# EAGLE board ST-BOARD-1-02 (EAGLE 9.3.0), part 1 of 2
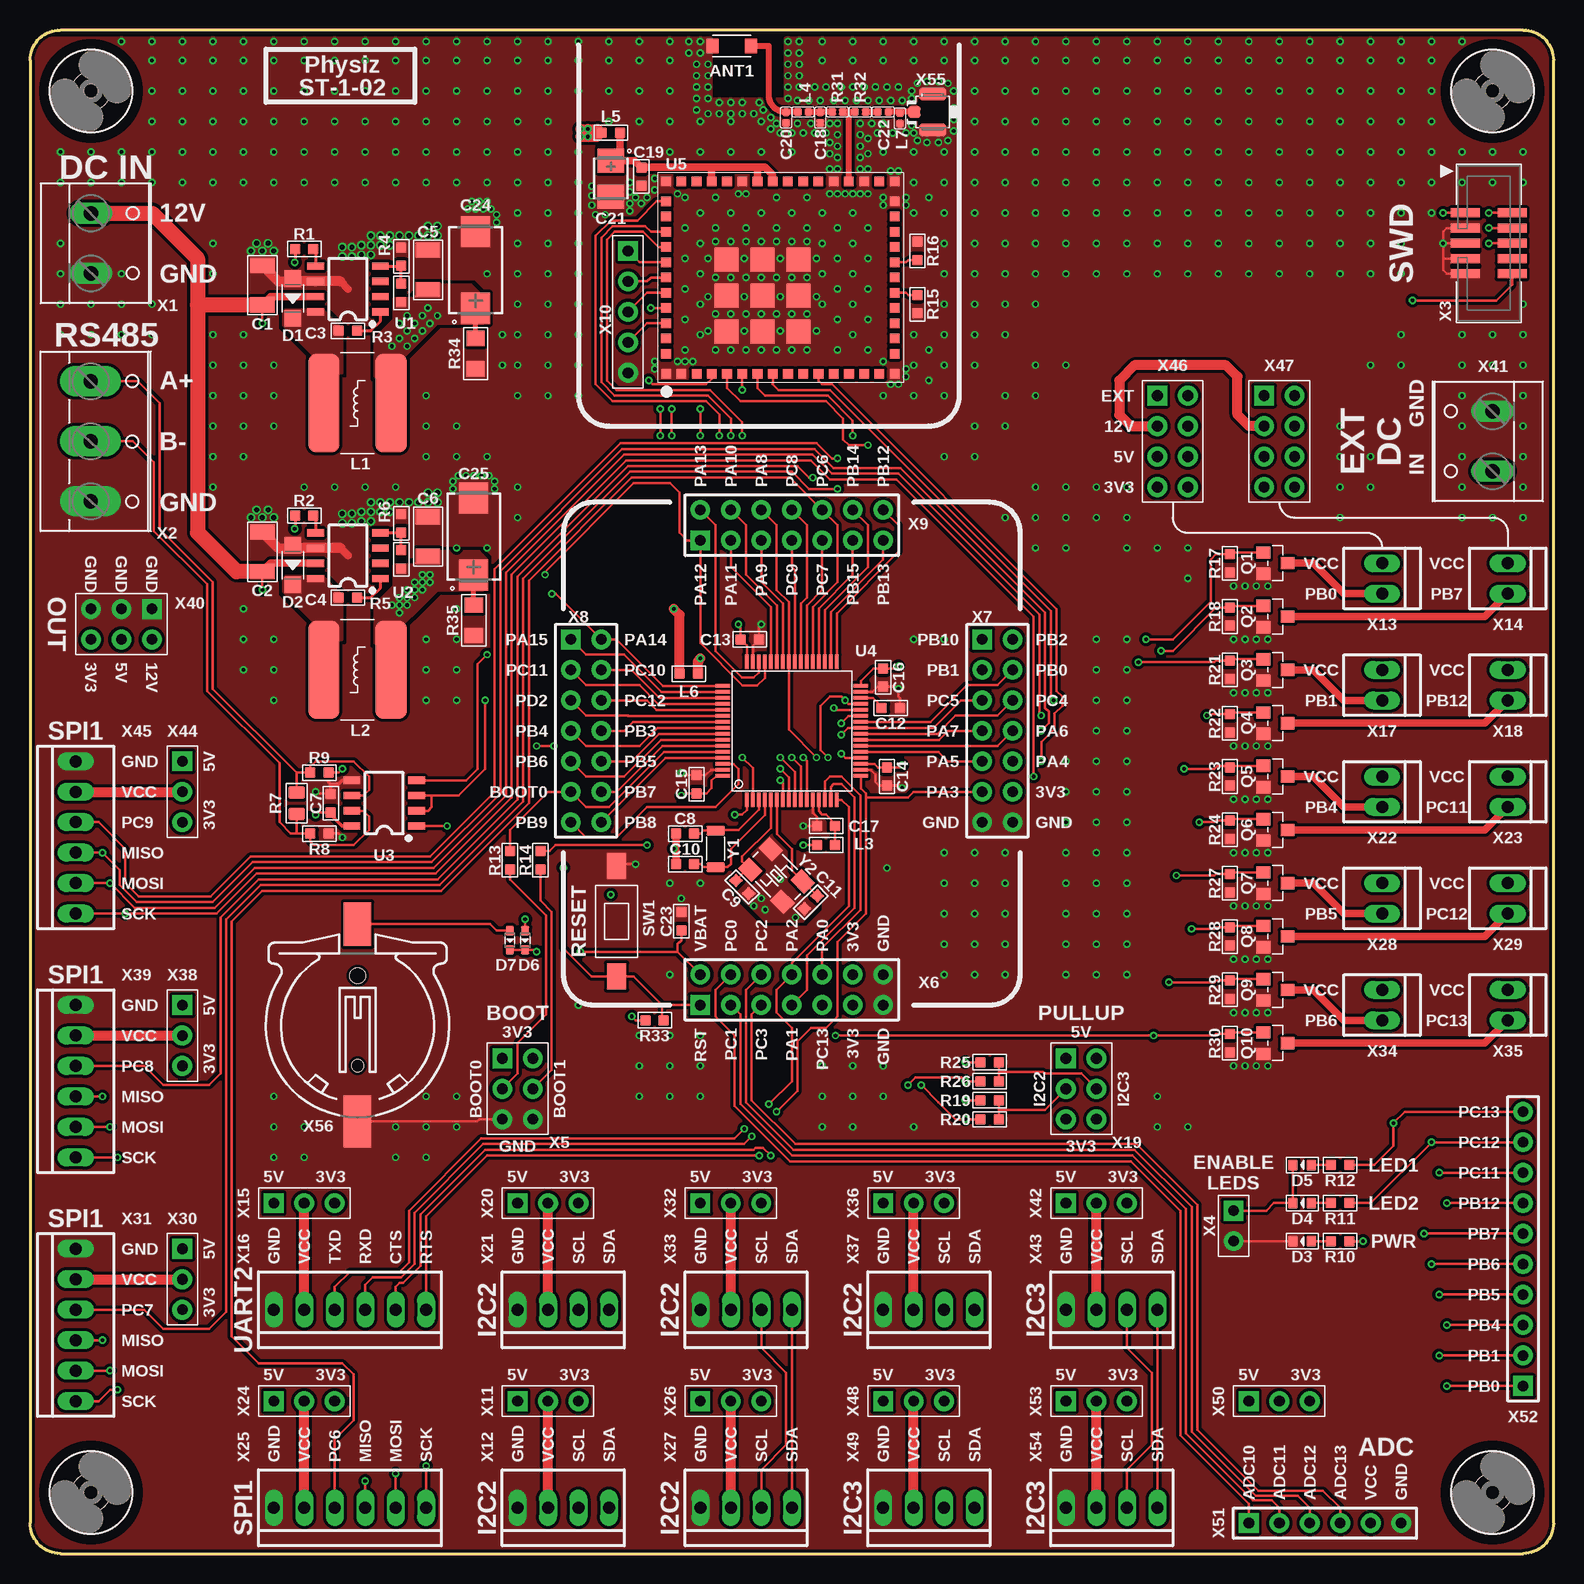
[diagram p4: board, top side]
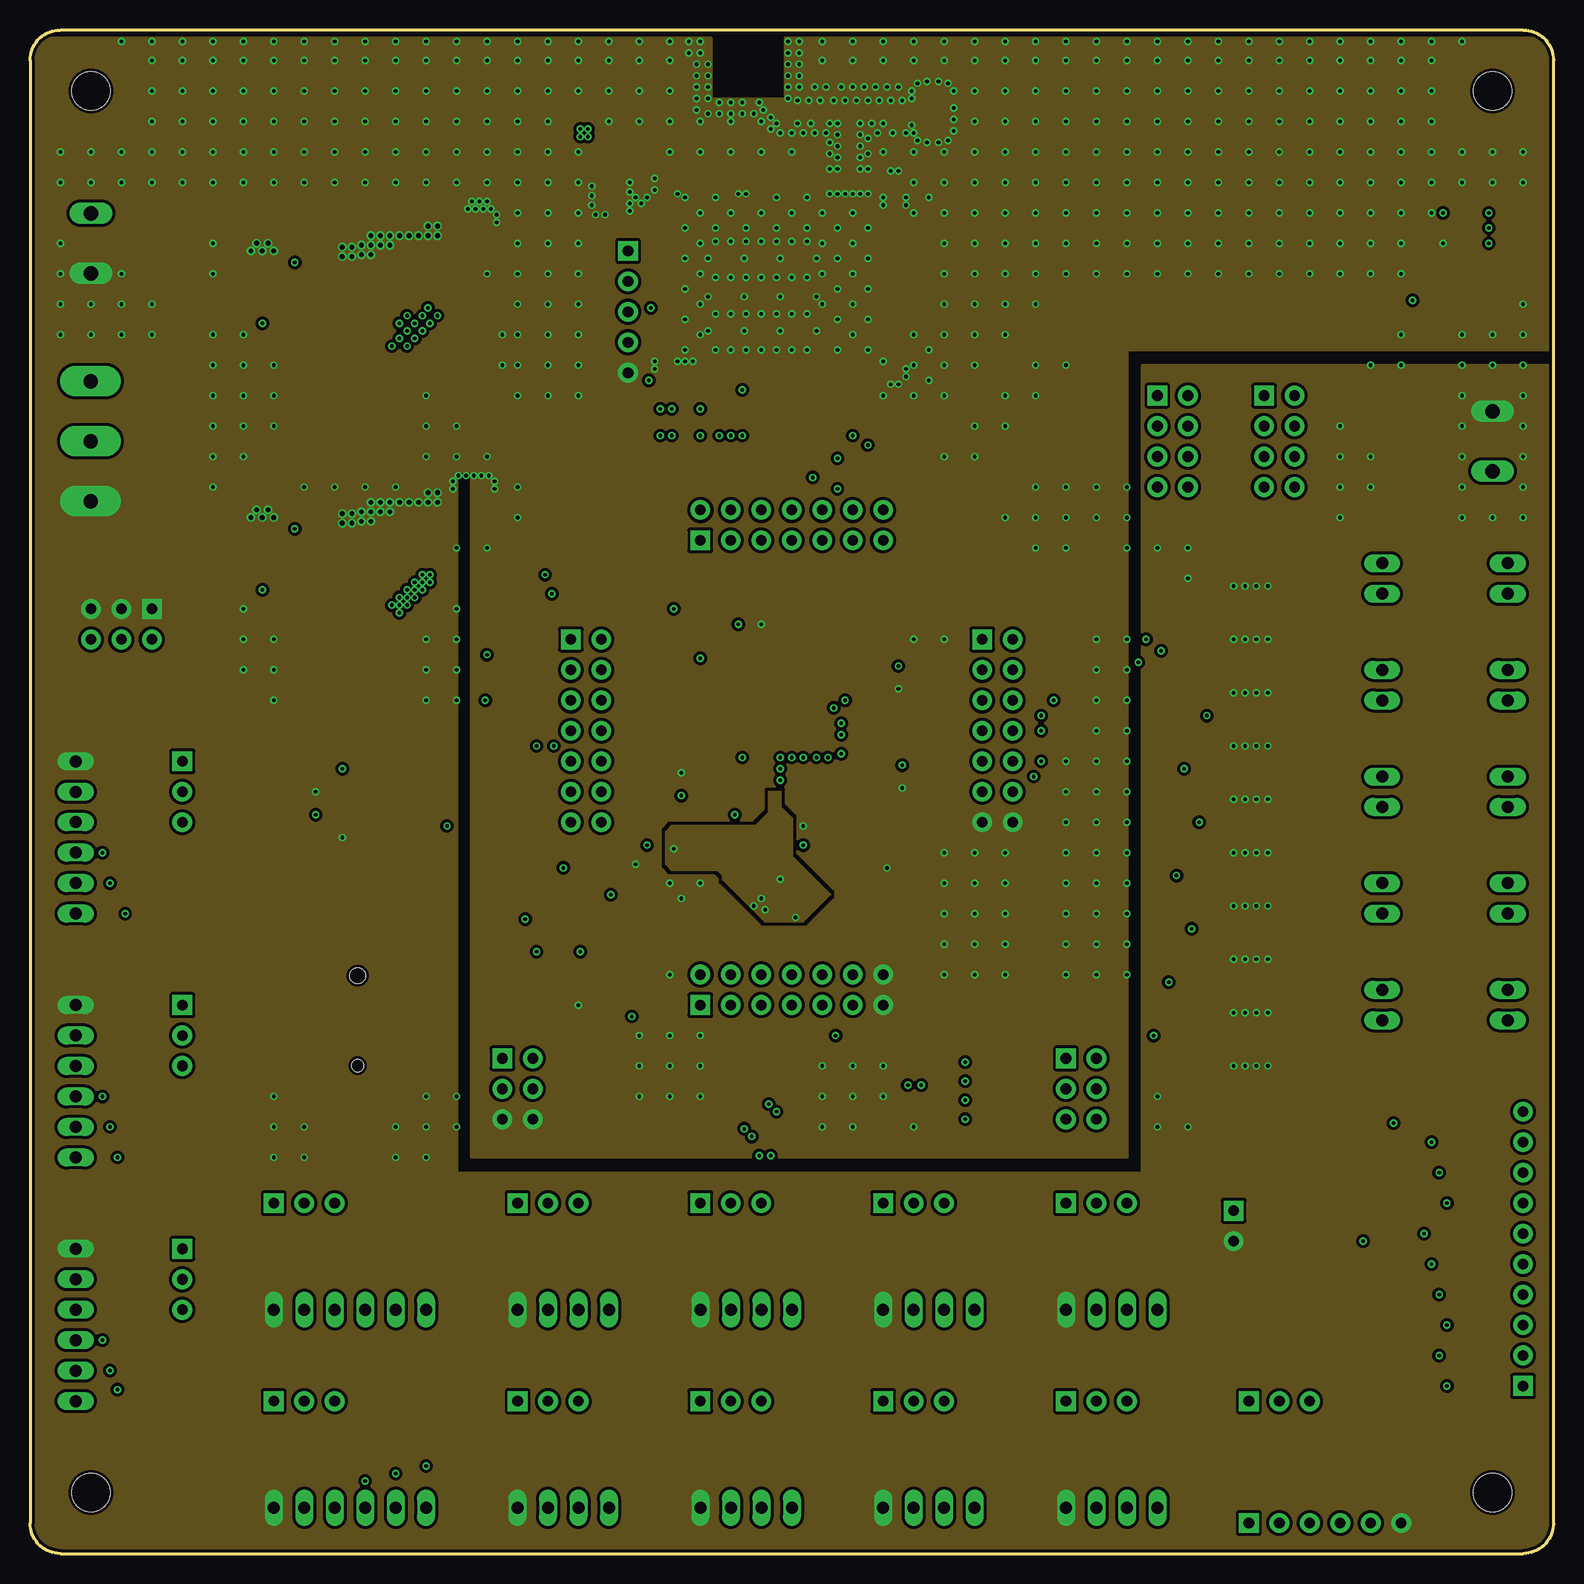
[diagram p5: board, inner layer GND]
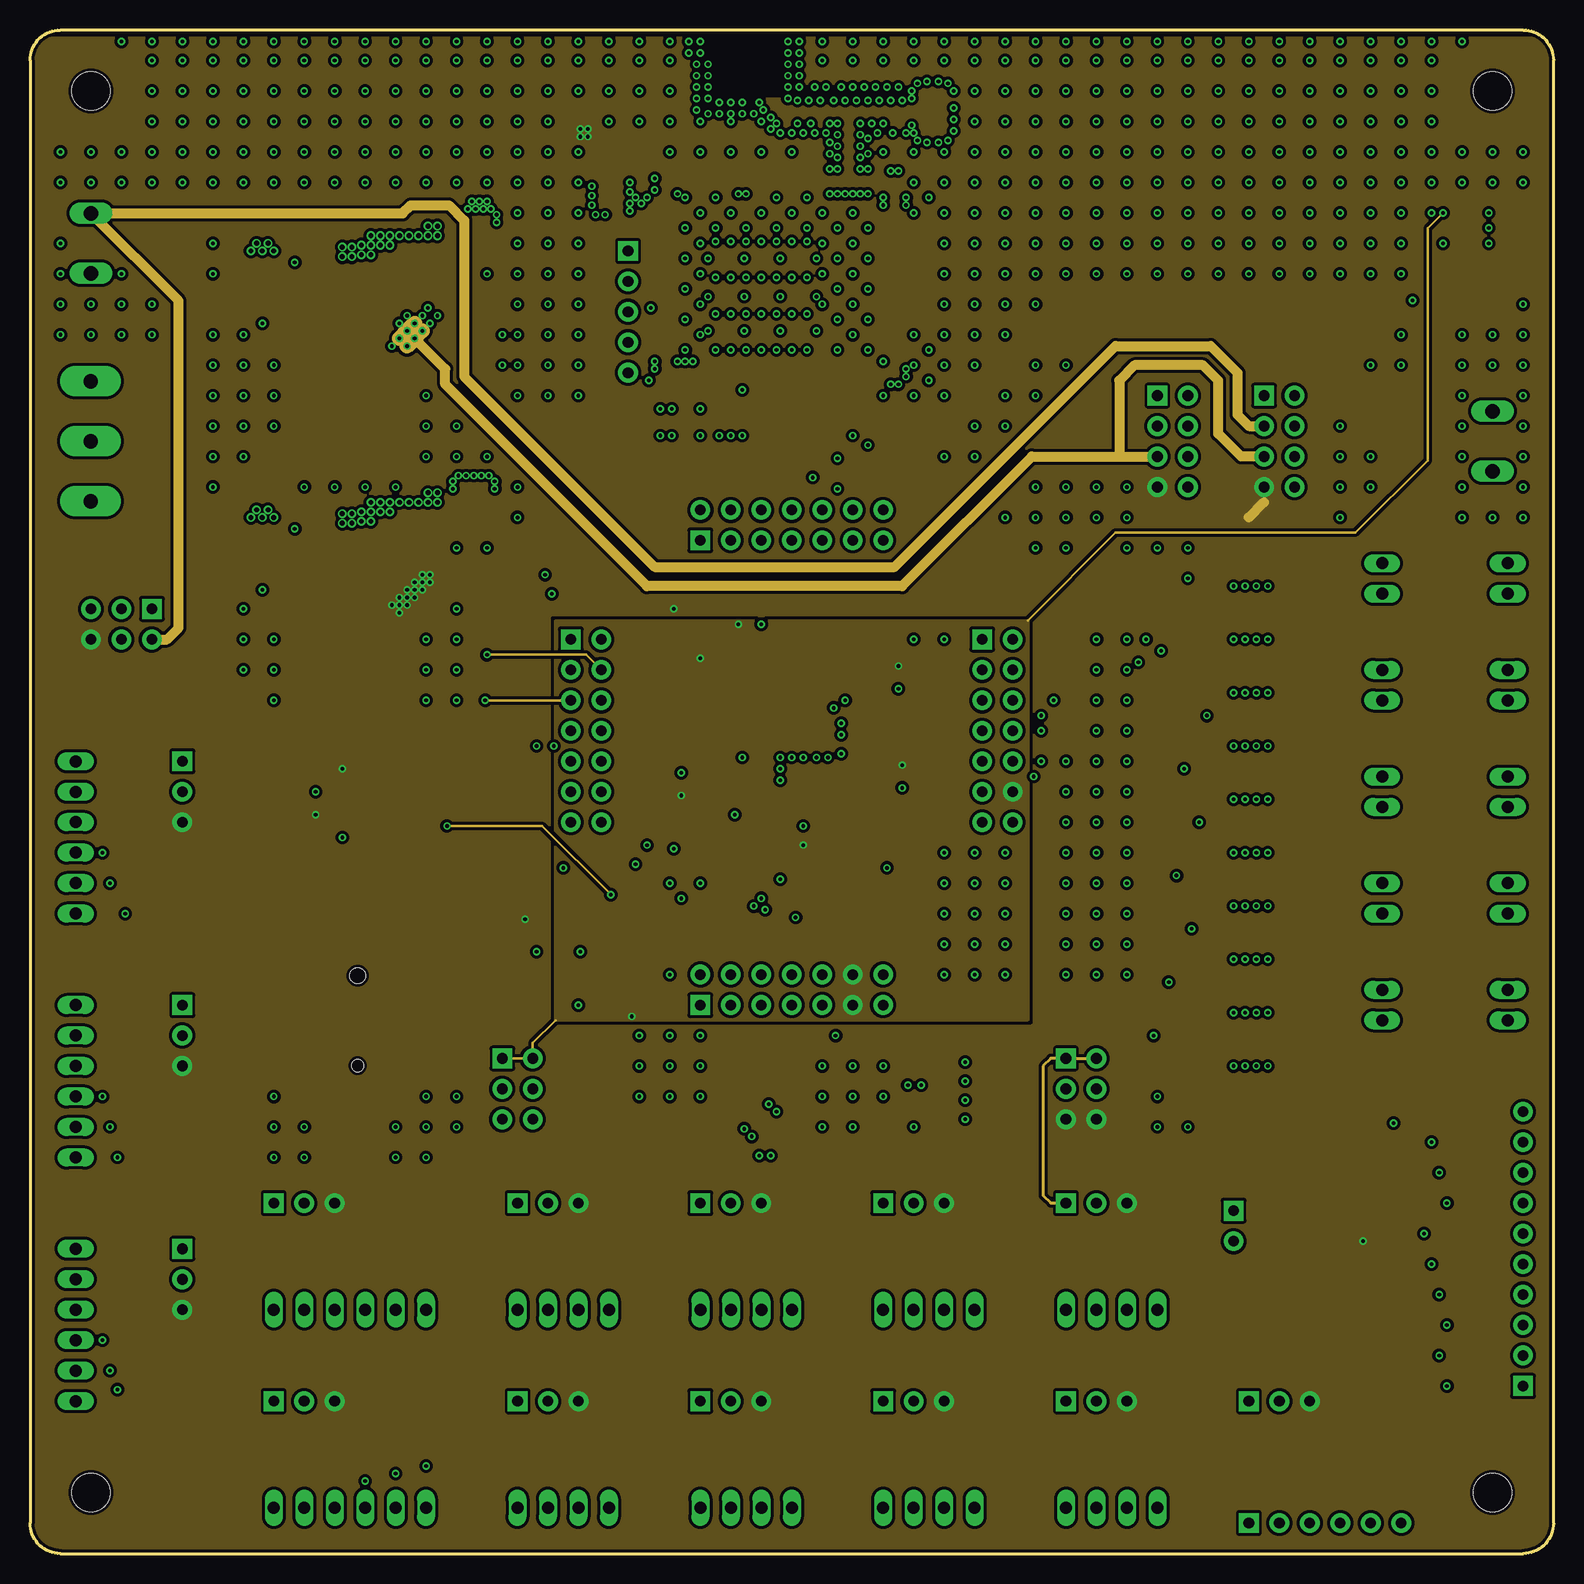
[diagram p6: board, inner layer VCC]
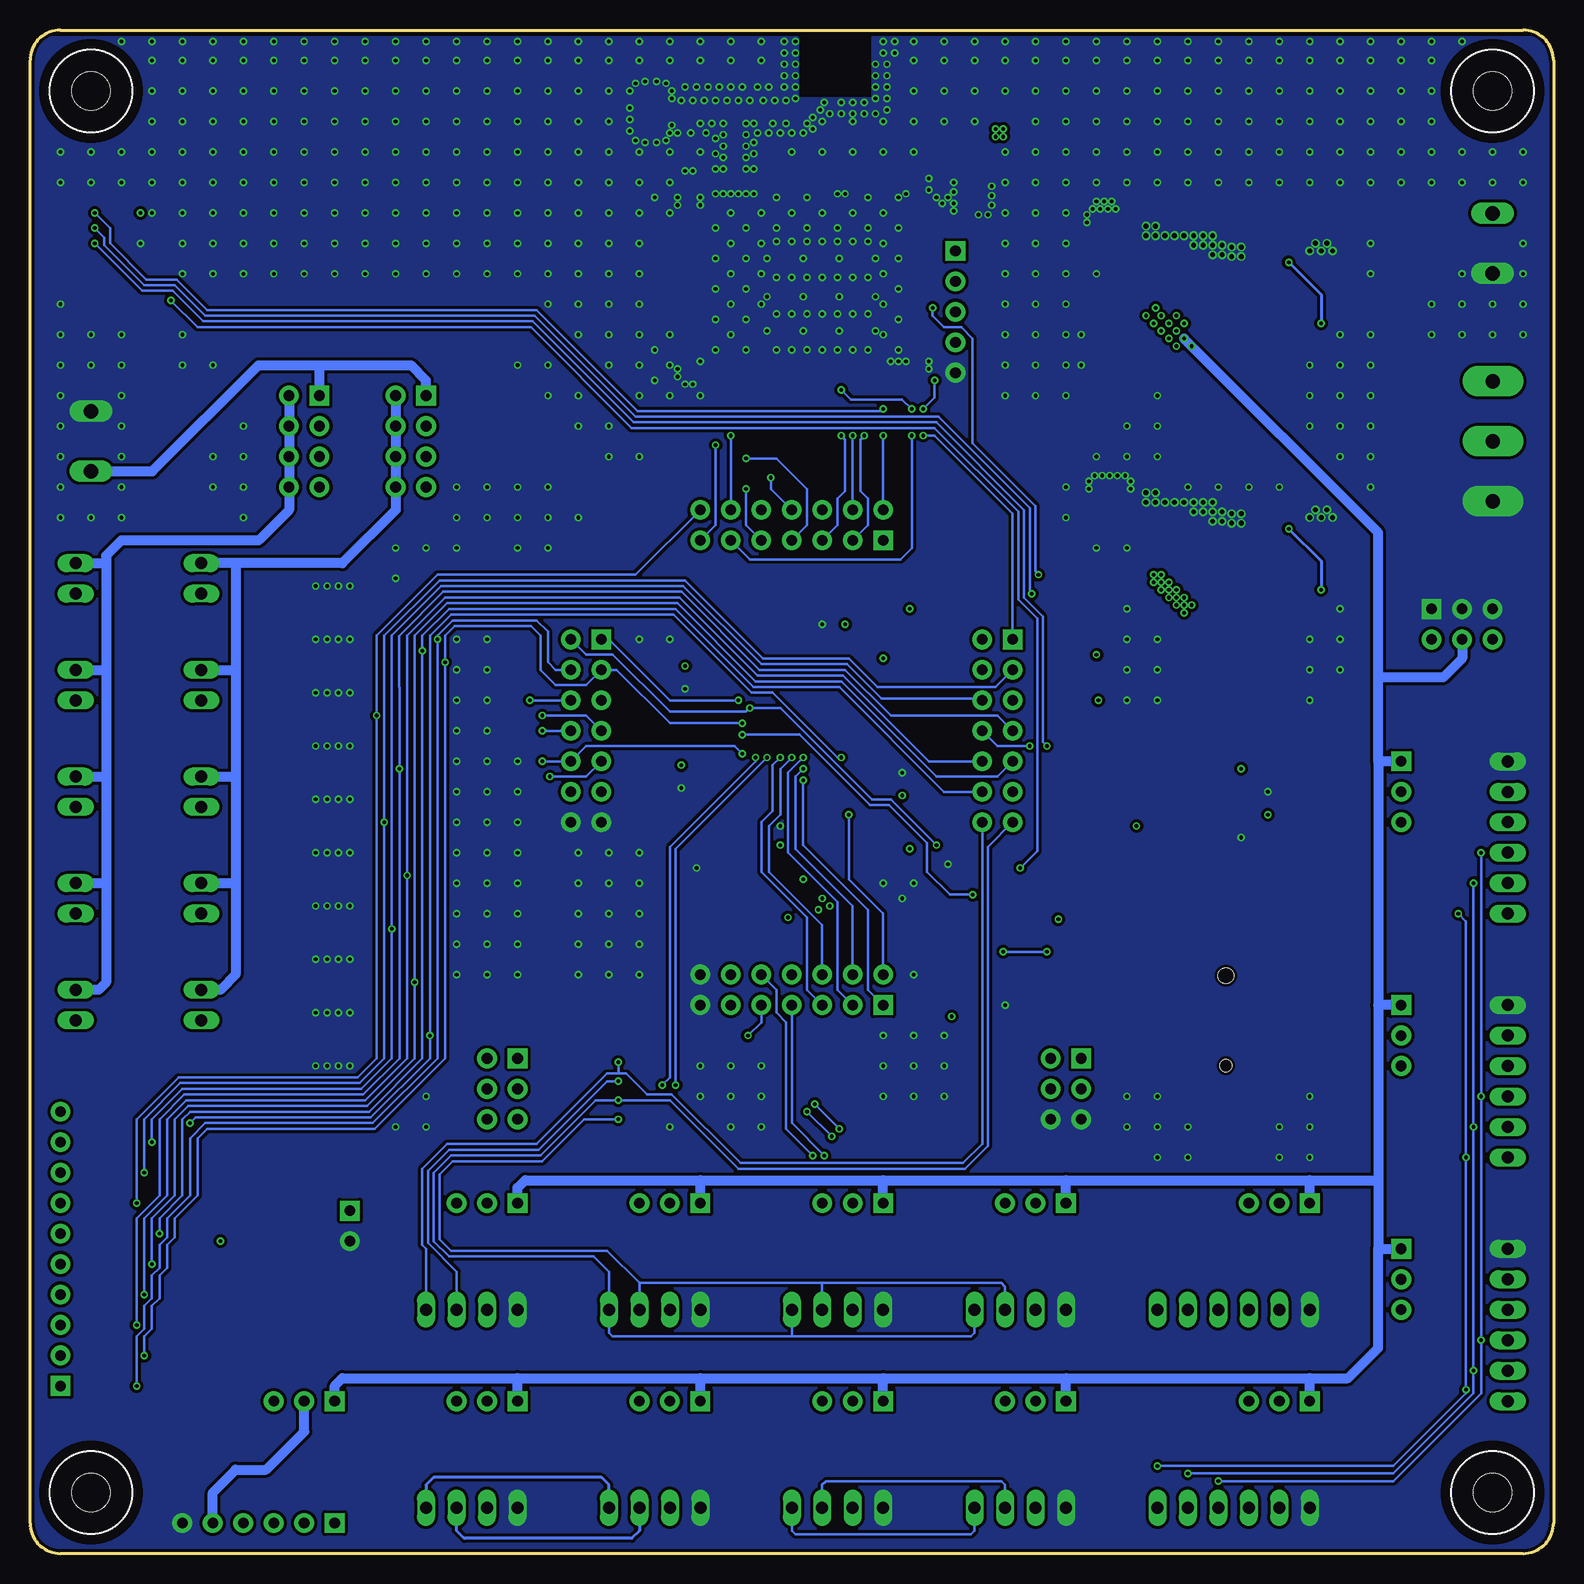
[diagram p7: board, bottom side, seen from below]

Size 127 x 127 mm. Coordinates in mm from the lower left corner, seen from the top.
Outline: 2.54,0 124.46,0 arc90 127,2.54 127,124.46 arc90 124.46,127 2.54,127 arc90 0,124.46 0,2.54 arc90 2.54,0
Copper layers (1*2+15*16): Top 0.018mm / dielectric 0.3mm / GND 0.018mm / dielectric 0.3mm / VCC 0.018mm / dielectric 0.3mm / Bottom 0.018mm
Design rules "rezonit_4_layers_18u_standart *": minimum track width 5mil, minimum drill 12mil, track to track 6mil, track to pad 6mil, pad to pad 5mil, via to via 6mil, smd to smd 5mil, copper to edge 10mil, drill to drill 10mil, minimum pad ring 10mil, minimum via ring 6mil, stop-mask expansion 2mil, vias tented up to drill 18mil, thermal gap 10mil
Net classes: 1 rf: width 0.508 mm, clearance 0.254 mm
tRestrict: 3 lines

## Footprints (pad centres in the part's own frame; a part is rotated, then mirrored left to right if it is on the bottom)
AH316M = smd 1 x 1.2: P$1 -1.6,0; P$2 1.6,0
C1206 = smd 1.27 x 2.032: 1 -1.651,0; 2 1.651,0
C0603 = smd 0.889 x 0.889: 1 0,0.762; 2 0,-0.762
C0402 = smd 0.635 x 0.635: 1 0,0.445; 2 0,-0.445
CT3528 = smd 2 x 2.2: + -1.5,0; - 1.5,0
CT7343 = smd 2.6 x 2.4: + 3.2,0; - -3.2,0
SOD-123 = smd 1.397 x 1.397: + -1.651,0; - 1.651,0
LED-0603 = smd 0.762 x 0.889: + -0.762,0; - 0.762,0
SOD-523 = smd 0.762 x 0.7: + -0.8,0; - 0.8,0
SRN8040 = smd 8.2 x 2.6: 1 0,2.8; 2 0,-2.8
L0603 = smd 0.889 x 0.889: 1 -0.762,0; 2 0.762,0
L0402 = smd 0.635 x 0.635: 1 -0.445,0; 2 0.445,0
SOT-23 = smd 1.016 x 1.143: 1 -0.889,-1.016; 2 0.889,-1.016; 3 0,1.016
R0603 = smd 0.889 x 0.889: 1 0,0.762; 2 0,-0.762
R0805 = smd 1.397 x 1.016: 1 0,0.889; 2 0,-0.889
R0402 = smd 0.635 x 0.635: 1 0,0.445; 2 0,-0.445
R1206 = smd 1.27 x 1.524: 1 -1.27,0; 2 1.27,0
TE-1437566-3 = smd 2.18 x 1.6: P$1 -4.6,0; P$2 4.6,0
SOIC8 = smd 0.6 x 1.4: 1 -1.905,-2.7; 2 -0.635,-2.7; 3 0.635,-2.7; 4 1.905,-2.7; 5 1.905,2.7; 6 0.635,2.7; 7 -0.635,2.7; 8 -1.905,2.7
LQFP64 = smd 0.3 x 1.2: 1 -3.75,-5.75; 2 -3.25,-5.75; 3 -2.75,-5.75; 4 -2.25,-5.75; 5 -1.75,-5.75; 6 -1.25,-5.75; 7 -0.75,-5.75; 8 -0.25,-5.75; 9 0.25,-5.75; 10 0.75,-5.75; 11 1.25,-5.75; 12 1.75,-5.75; 13 2.25,-5.75; 14 2.75,-5.75; 15 3.25,-5.75; 16 3.75,-5.75; 33 3.75,5.75; 34 3.25,5.75; 35 2.75,5.75; 36 2.25,5.75; 37 1.75,5.75; 38 1.25,5.75; 39 0.75,5.75; 40 0.25,5.75; 41 -0.25,5.75; 42 -0.75,5.75; 43 -1.25,5.75; 44 -1.75,5.75; 45 -2.25,5.75; 46 -2.75,5.75; 47 -3.25,5.75; 48 -3.75,5.75 | smd 1.2 x 0.3: 17 5.75,-3.75; 18 5.75,-3.25; 19 5.75,-2.75; 20 5.75,-2.25; 21 5.75,-1.75; 22 5.75,-1.25; 23 5.75,-0.75; 24 5.75,-0.25; 25 5.75,0.25; 26 5.75,0.75; 27 5.75,1.25; 28 5.75,1.75; 29 5.75,2.25; 30 5.75,2.75; 31 5.75,3.25; 32 5.75,3.75; 49 -5.75,3.75; 50 -5.75,3.25; 51 -5.75,2.75; 52 -5.75,2.25; 53 -5.75,1.75; 54 -5.75,1.25; 55 -5.75,0.75; 56 -5.75,0.25; 57 -5.75,-0.25; 58 -5.75,-0.75; 59 -5.75,-1.25; 60 -5.75,-1.75; 61 -5.75,-2.25; 62 -5.75,-2.75; 63 -5.75,-3.25; 64 -5.75,-3.75
CC3100MOD = smd 0.8 x 0.8: P1 9.52,8.025; P2 8.25,8.025; P3 6.98,8.025; P4 5.71,8.025; P5 4.44,8.025; P6 3.17,8.025; P7 1.9,8.025; P8 0.63,8.025; P9 -0.64,8.025; P10 -1.91,8.025; P11 -3.18,8.025; P12 -4.45,8.025; P13 -5.72,8.025; P14 -6.99,8.025; P15 -8.26,8.025; P16 -9.53,8.025; P17 -9.525,6.35; P18 -9.525,5.08; P19 -9.525,3.81; P20 -9.525,2.54; P21 -9.525,1.27; P22 -9.525,0; P23 -9.525,-1.27; P24 -9.525,-2.54; P25 -9.525,-3.81; P26 -9.525,-5.08; P27 -9.525,-6.35; P28 -9.525,-8.02; P29 -8.255,-8.02; P30 -6.985,-8.02; P31 -5.715,-8.02; P32 -4.445,-8.02; P33 -3.175,-8.02; P34 -1.905,-8.02; P35 -0.635,-8.02; P36 0.635,-8.02; P37 1.905,-8.02; P38 3.175,-8.02; P39 4.445,-8.02; P40 5.715,-8.02; P41 6.985,-8.02; P42 8.255,-8.02; P43 9.525,-8.02; P44 9.525,-6.35; P45 9.525,-5.08; P46 9.525,-3.81; P47 9.525,-2.54; P48 9.525,-1.27; P49 9.525,0; P50 9.525,1.27; P51 9.525,2.54; P52 9.525,3.81; P53 9.525,5.08; P54 9.525,6.35 | smd 2 x 2: P55 4.5,4.5; P56 1.5,-1.5; P57 -1.5,4.5; P58 4.5,1.5; P59 1.5,1.5; P60 -1.5,1.5; P61 4.5,-1.5; P62 1.5,4.5; P63 -1.5,-1.5
3,2 = hole 3.2: 0,0
W237-102 = drill 1.194 long: 1 -2.5,-1.27; 2 2.5,-1.27
W237-103 = drill 1.194 pad 2.54 long: 1 -5,-1.29; 2 0,-1.29; 3 5,-1.29
2X05_1.27MM_BOX_NOPOSTS = smd 0.76 x 2.4: 1 -2.54,-1.95; 2 -2.54,1.95; 3 -1.27,-1.95; 4 -1.27,1.95; 5 0,-1.95; 6 0,1.95; 7 1.27,-1.95; 8 1.27,1.95; 9 2.54,-1.95; 10 2.54,1.95
H2-2.54 = drill 0.889 pad 1.651 square: 1 0,1.27 | drill 0.889 pad 1.651: 2 0,-1.27
H2X3-2.54 = drill 0.889 pad 1.651 square: 1 -1.27,2.54 | drill 0.889 pad 1.651: 2 -1.27,0; 3 -1.27,-2.54; 4 1.27,-2.54; 5 1.27,0; 6 1.27,2.54
H2X7-2.54 = drill 0.889 pad 1.651 square: 1 -1.27,7.62 | drill 0.889 pad 1.651: 2 -1.27,5.08; 3 -1.27,2.54; 4 -1.27,0; 5 -1.27,-2.54; 6 -1.27,-5.08; 7 -1.27,-7.62; 8 1.27,-7.62; 9 1.27,-5.08; 10 1.27,-2.54; 11 1.27,0; 12 1.27,2.54; 13 1.27,5.08; 14 1.27,7.62
H5-2.54 = drill 0.889 pad 1.651 square: 1 0,5.08 | drill 0.889 pad 1.651: 2 0,2.54; 3 0,0; 4 0,-2.54; 5 0,-5.08
H3-2.54 = drill 0.889 pad 1.651 square: 1 0,2.54 | drill 0.889 pad 1.651: 2 0,0; 3 0,-2.54
22-23-2041 = drill 1 long: 1 -3.81,0; 2 -1.27,0; 3 1.27,0; 4 3.81,0
22-23-2021 = drill 1 long: 1 -1.27,0; 2 1.27,0
22-23-2061 = drill 1 long: 1 -6.35,0; 2 -3.81,0; 3 -1.27,0; 4 1.27,0; 5 3.81,0; 6 6.35,0
H2X4-2.54 = drill 0.889 pad 1.651 square: 1 -1.27,3.81 | drill 0.889 pad 1.651: 2 -1.27,1.27; 3 -1.27,-1.27; 4 -1.27,-3.81; 5 1.27,-3.81; 6 1.27,-1.27; 7 1.27,1.27; 8 1.27,3.81
H6-2.54 = drill 0.889 pad 1.651 square: 1 0,-13.97 | drill 0.889 pad 1.651: 2 0,-11.43; 3 0,-8.89; 4 0,-6.35; 5 0,-3.81; 6 0,-1.27
H10-2.54 = drill 0.889 pad 1.651 square: 1 0,-11.43 | drill 0.889 pad 1.651: 2 0,-8.89; 3 0,-6.35; 4 0,-3.81; 5 0,-1.27; 6 0,1.27; 7 0,3.81; 8 0,6.35; 9 0,8.89; 10 0,11.43
U-FL3P-SMD-2.6X2.6X1.0MM = smd 1.05 x 1: D -1.524,0 | smd 2.2 x 1.05: GND1 0,1.5; GND2 0,-1.5
CH291-1220LF = smd 2.3 x 3.66: + 0,-2.296 | smd 2.3 x 4.3: - 0,14.146 | hole 1.3: 0,2 | hole 1: 0,9.5
3.2X1.5 = smd 0.762 x 1.524: 1 -1.524,0; 2 1.524,0
IQG5032B = smd 1.6 x 1.3: 1 -1.9,-1.2; 2 1.9,-1.2; 3 1.9,1.2; 4 -1.9,1.2

## Placement (x,y rotation side)
ANT1  AH316M245001-T  [AH316M]  58.5,125.65 180 top
C1  10uF  [C1206]  19.37,105.73 90 top
C2  10uF  [C1206]  19.37,83.5 90 top
C3  10nF  [C0603]  26.51,101.92 270 top
C4  10nF  [C0603]  26.51,79.69 270 top
C5  100uF  [C1206]  33.18,107 270 top
C6  100uF  [C1206]  33.18,84.77 270 top
C7  0.1 uF  [C0603]  25.08,62.55 180 top
C8  12 pF  [C0603]  54.61,60.01 90 top
C9  18 pF  [C0603]  59.37,55.56 225 top
C10  12 pF  [C0603]  54.61,57.47 90 top
C11  18 pF  [C0603]  65.09,54.29 135 top
C12  2.2 uF  [C0603]  71.75,70.48 90 top
C13  0.1 uF  [C0603]  60.01,76.2 90 top
C14  0.1 uF  [C0603]  71.44,64.77 0 top
C15  0.1 uF  [C0603]  55.56,64.14 180 top
C16  0.1 uF  [C0603]  71.12,73.03 0 top
C17  0.1 uF  [C0603]  66.36,60.64 270 top
C18  DNP  [C0402]  65.88,119.7 180 top
C19  0.1 uF  [C0603]  50.96,114.78 0 top
C20  1 pF  [C0402]  63.02,119.7 180 top
C21  100 uF  [CT3528]  48.42,114.62 270 top
C22  10 pF  [C0402]  71.12,120.17 270 top
C23  0.1 uF  [C0603]  54.29,52.7 180 top
C24  100 uF  [CT7343]  37.15,107 270 top
C25  100 uF  [CT7343]  36.99,84.77 270 top
D1  STPS140Z  [SOD-123]  21.91,104.62 270 top
D2  STPS140Z  [SOD-123]  21.91,82.39 270 top
D3  [LED-0603]  106.05,26.04 180 top
D4  [LED-0603]  106.05,29.21 180 top
D5  [LED-0603]  106.05,32.38 180 top
D6  [SOD-523]  41.27,51.12 270 top
D7  [SOD-523]  40.01,51.12 270 top
DRILEGEND  [DRILEGEND]  1.84,-48.32 0 top  (outside the outline)
L1  SRN8040-330M  [SRN8040]  27.3,95.89 90 top
L2  SRN8040-330M  [SRN8040]  27.3,73.66 90 top
L3  [L0603]  66.36,59.05 180 top
L4  [L0402]  64.45,120.17 180 top
L5  [L0603]  48.42,118.43 180 top
L6  [L0603]  54.93,73.34 0 top
L7  DNP  [L0402]  72.52,119.63 270 top
Q1  [SOT-23]  103.82,82.55 270 top
Q2  [SOT-23]  103.82,78.11 270 top
Q3  [SOT-23]  103.82,73.66 270 top
Q4  [SOT-23]  103.82,69.22 270 top
Q5  [SOT-23]  103.82,64.77 270 top
Q6  [SOT-23]  103.82,60.33 270 top
Q7  [SOT-23]  103.82,55.88 270 top
Q8  [SOT-23]  103.82,51.44 270 top
Q9  [SOT-23]  103.82,46.99 270 top
Q10  [SOT-23]  103.82,42.55 270 top
R1  470K  [R0603]  22.86,108.74 270 top
R2  470K  [R0603]  22.86,86.52 270 top
R3  10K  [R0603]  30.96,105.09 0 top
R4  3.24K  [R0603]  30.96,108.11 0 top
R5  10K  [R0603]  30.96,82.87 0 top
R6  5.9K  [R0603]  30.96,85.88 0 top
R7  150  [R0805]  22.23,62.55 180 top
R8  330  [R0603]  24.13,60.01 270 top
R9  330  [R0603]  24.13,65.09 270 top
R10  1K  [R0603]  109.22,26.04 270 top
R11  1K  [R0603]  109.22,29.21 270 top
R12  1K  [R0603]  109.22,32.38 270 top
R13  1K  [R0603]  40.01,57.78 0 top
R14  1K  [R0603]  42.55,57.78 0 top
R15  100K  [R0603]  73.98,104.14 180 top
R16  10K  [R0603]  73.98,108.58 0 top
R17  [R0603]  100.01,82.55 180 top
R18  [R0603]  100.01,78.11 180 top
R19  [R0603]  80.01,37.78 90 top
R20  [R0603]  80.01,36.2 90 top
R21  [R0603]  100.01,73.66 180 top
R22  [R0603]  100.01,69.22 180 top
R23  [R0603]  100.01,64.77 180 top
R24  [R0603]  100.01,60.33 180 top
R25  [R0603]  80.01,40.96 90 top
R26  [R0603]  80.01,39.37 90 top
R27  [R0603]  100.01,55.88 180 top
R28  [R0603]  100.01,51.44 180 top
R29  [R0603]  100.01,46.99 180 top
R30  [R0603]  100.01,42.55 180 top
R31  0R  [R0402]  67.31,120.17 270 top
R32  DNP  [R0402]  69.22,120.17 90 top
R33  100K  [R0603]  52.07,44.45 90 top
R34  270  [R1206]  37.15,100.01 90 top
R35  180  [R1206]  36.99,77.79 90 top
SW1  [TE-1437566-3]  48.9,52.7 90 top
U1  TPS5410DR  [SOIC8]  26.51,105.41 90 top
U2  TPS5410DR  [SOIC8]  26.51,83.19 90 top
U3  MAX3485EESA+T  [SOIC8]  29.53,62.55 90 top
U4  STM32F412RGT  [LQFP64]  63.5,68.58 0 top
U5  [CC3100MOD]  62.55,106.36 180 top
U$1  [3,2]  5.08,5.08 0 top
U$2  [3,2]  121.92,5.08 0 top
U$3  [3,2]  5.08,121.92 0 top
U$4  [3,2]  121.92,121.92 0 top
U$5  [A4P-LOC]  -31.43,-105.73 0 top  (outside the outline)
X1  TE-282836-2  [W237-102]  6.35,109.22 270 top
X2  TE-282836-3  [W237-103]  6.35,92.71 270 top
X3  3220-10-0300-00  [2X05_1.27MM_BOX_NOPOSTS]  121.6,109.22 270 top
X4  2p-2.54  [H2-2.54]  100.33,27.3 0 top
X5  2x3p-2.54  [H2X3-2.54]  40.64,38.73 0 top
X6  [H2X7-2.54]  63.5,46.99 90 top
X7  [H2X7-2.54]  80.64,68.58 0 top
X8  [H2X7-2.54]  46.35,68.58 0 top
X9  [H2X7-2.54]  63.5,85.72 90 top
X10  2p-2.54  [H5-2.54]  49.85,103.5 0 top
X11  3p-2.54  [H3-2.54]  43.18,12.7 90 top
X12  [22-23-2041]  44.45,3.81 180 top
X13  2p-2.54  [22-23-2021]  112.71,81.28 270 top
X14  2p-2.54  [22-23-2021]  123.19,81.28 270 top
X15  3p-2.54  [H3-2.54]  22.86,29.21 90 top
X16  [22-23-2061]  26.67,20.32 180 top
X17  2p-2.54  [22-23-2021]  112.71,72.39 270 top
X18  2p-2.54  [22-23-2021]  123.19,72.39 270 top
X19  2x3p-2.54  [H2X3-2.54]  87.63,38.73 0 top
X20  3p-2.54  [H3-2.54]  43.18,29.21 90 top
X21  [22-23-2041]  44.45,20.32 180 top
X22  2p-2.54  [22-23-2021]  112.71,63.5 270 top
X23  2p-2.54  [22-23-2021]  123.19,63.5 270 top
X24  3p-2.54  [H3-2.54]  22.86,12.7 90 top
X25  [22-23-2061]  26.67,3.81 180 top
X26  3p-2.54  [H3-2.54]  58.42,12.7 90 top
X27  [22-23-2041]  59.69,3.81 180 top
X28  2p-2.54  [22-23-2021]  112.71,54.61 270 top
X29  2p-2.54  [22-23-2021]  123.19,54.61 270 top
X30  3p-2.54  [H3-2.54]  12.7,22.86 0 top
X31  [22-23-2061]  3.81,19.05 90 top
X32  3p-2.54  [H3-2.54]  58.42,29.21 90 top
X33  [22-23-2041]  59.69,20.32 180 top
X34  2p-2.54  [22-23-2021]  112.71,45.72 270 top
X35  2p-2.54  [22-23-2021]  123.19,45.72 270 top
X36  3p-2.54  [H3-2.54]  73.66,29.21 90 top
X37  [22-23-2041]  74.93,20.32 180 top
X38  3p-2.54  [H3-2.54]  12.7,43.18 0 top
X39  [22-23-2061]  3.81,39.37 90 top
X40  2x3p-2.54  [H2X3-2.54]  7.62,77.47 270 top
X41  TE-282836-2  [W237-102]  120.65,92.71 90 top
X42  3p-2.54  [H3-2.54]  88.9,29.21 90 top
X43  [22-23-2041]  90.17,20.32 180 top
X44  3p-2.54  [H3-2.54]  12.7,63.5 0 top
X45  [22-23-2061]  3.81,59.69 90 top
X46  2x4p-2.54  [H2X4-2.54]  95.25,92.71 0 top
X47  2x4p-2.54  [H2X4-2.54]  104.14,92.71 0 top
X48  3p-2.54  [H3-2.54]  73.66,12.7 90 top
X49  [22-23-2041]  74.93,3.81 180 top
X50  3p-2.54  [H3-2.54]  104.14,12.7 90 top
X51  [H6-2.54]  115.57,2.54 270 top
X52  [H10-2.54]  124.46,25.4 0 top
X53  3p-2.54  [H3-2.54]  88.9,12.7 90 top
X54  [22-23-2041]  90.17,3.81 180 top
X55  [U-FL3P-SMD-2.6X2.6X1.0MM]  75.25,120.17 0 top
X56  CH291-1220LF  [CH291-1220LF]  27.3,50.16 180 top
Y1  32.768KHZ  [3.2X1.5]  57.15,58.74 270 top
Y2  8 Mhz  [IQG5032B]  62.23,56.52 315 top